# EAGLE design 3y-ym-2xxxy-psu-breakout (EAGLE 9.6.2)
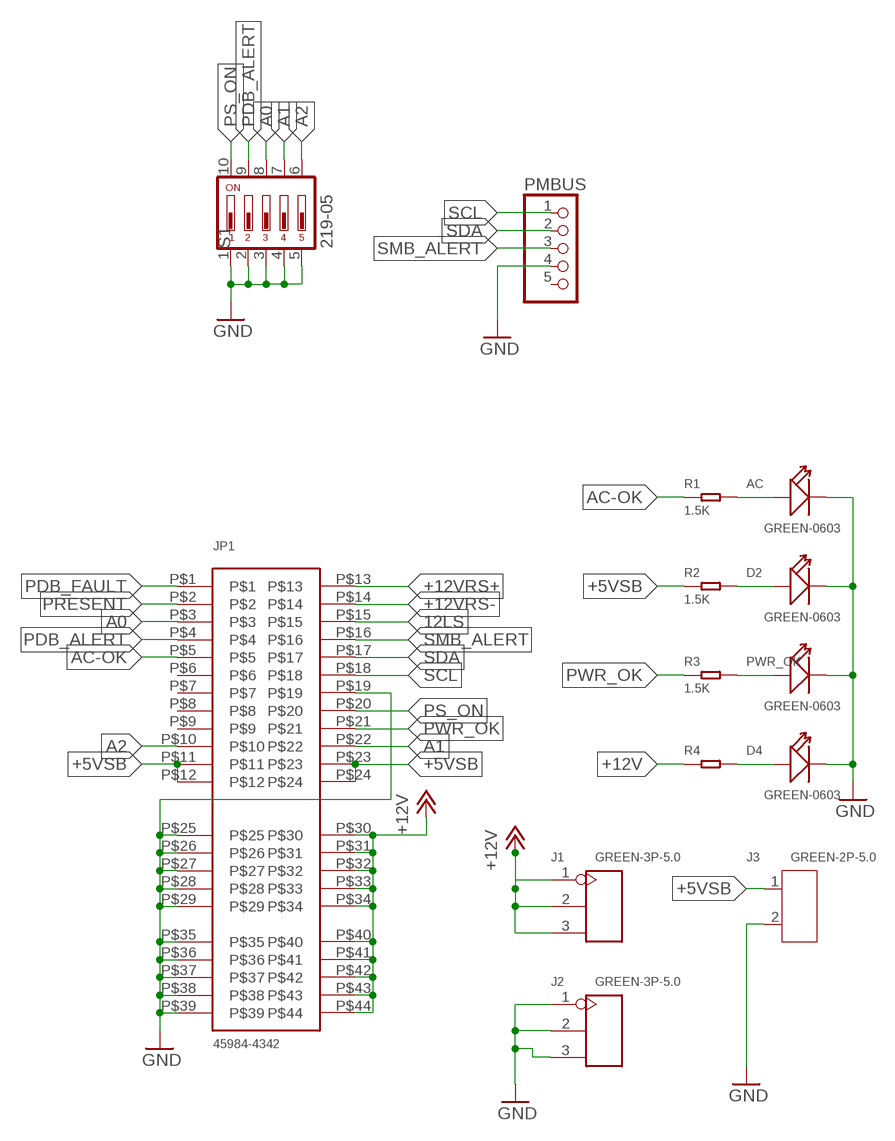
[diagram p0: schematic, sheet 1]

## Parts
AC  GREEN-0603  SMD-LED-CLEAR-GREEN(0603)  [LED-0603]
D2  GREEN-0603  SMD-LED-CLEAR-GREEN(0603)  [LED-0603]
D4  GREEN-0603  SMD-LED-CLEAR-GREEN(0603)  [LED-0603]
J1  GREEN-3P-5.0  SCREW-TERMINAL-GREEN(3P-5.0)  [H3-5.0-15.5X8.0MM]
J2  GREEN-3P-5.0  SCREW-TERMINAL-GREEN(3P-5.0)  [H3-5.0-15.5X8.0MM]
J3  GREEN-2P-5.0  SCREW-TERMINAL-GREEN(2P-5.0)  [H2-5.0-10.5X8.0MM]
JP1  45984-4342  [45984-4342]
PMBUS  PINHD-1X5  [1X05]
PWR_OK  GREEN-0603  SMD-LED-CLEAR-GREEN(0603)  [LED-0603]
R1  1.5K  SMD-RES-150R-1%-1/10W(0603)  [R0603]
R2  1.5K  SMD-RES-150R-1%-1/10W(0603)  [R0603]
R3  1.5K  SMD-RES-150R-1%-1/10W(0603)  [R0603]
R4  1.5K  SMD-RES-510R-1%-1/10W(0603)  [R0603]
S1  219-05  [CTS-219-05]

## Nets
12LS: JP1.P$15
+5VSB: J3.1 JP1.P$11 JP1.P$12 JP1.P$23 JP1.P$24 R2.1
+12V: J1.1 J1.2 J1.3 JP1.P$30 JP1.P$31 JP1.P$32 JP1.P$33 JP1.P$34 JP1.P$40 JP1.P$41 JP1.P$42 JP1.P$43 JP1.P$44 R4.1
+12VRS+: JP1.P$13
+12VRS-: JP1.P$14
A0: JP1.P$3 S1.8
A1: JP1.P$22 S1.7
A2: JP1.P$10 S1.6
AC-OK: JP1.P$5 R1.1
GND: AC.- D2.- D4.- J2.1 J2.2 J2.3 J3.2 JP1.P$19 JP1.P$25 JP1.P$26 JP1.P$27 JP1.P$28 JP1.P$29 JP1.P$35 JP1.P$36 JP1.P$37 JP1.P$38 JP1.P$39 PMBUS.4 PWR_OK.- S1.1 S1.2 S1.3 S1.4 S1.5
N$2: AC.+ R1.2
N$3: D2.+ R2.2
N$4: PWR_OK.+ R3.2
N$5: D4.+ R4.2
PDB_ALERT: JP1.P$4 S1.9
PDB_FAULT: JP1.P$1
PRESENT: JP1.P$2
PS_ON: JP1.P$20 S1.10
PWR_OK: JP1.P$21 R3.1
SCL: JP1.P$18 PMBUS.1
SDA: JP1.P$17 PMBUS.2
SMB_ALERT: JP1.P$16 PMBUS.3
Unconnected: JP1.P$6 JP1.P$7 JP1.P$8 JP1.P$9 PMBUS.5

## Library data of the parts
AC D2 D4 PWR_OK = OPL_Optoelectronics:SMD-LED-CLEAR-GREEN(0603): 304090043; MPN: 19-217-G7C-AN1P2-3T
J1 J2 = OPL_Connector:SCREW-TERMINAL-GREEN(3P-5.0): 320110029
J3 = OPL_Connector:SCREW-TERMINAL-GREEN(2P-5.0): 320110031
JP1 = Molex EXTreme LPHPower:45984-4342: 459844342 1.27mm, 12.00mm Pitch, EXTreme LPHPower Receptacle Header, Right-Angle, 4 Power Contacts, 24 Signal Contacts, Select Gold (Au) Plating, for 2.36mm Thick PC Board, with Press-fit Plastic Pegs Series: 45984 <https://www.molex.com/molex/search/partSearch?query=45984&pQuery=> Category: PCB Receptacles Overview: EXTreme LPHPower Connectors <https://www.molex.com/molex/products/family/extreme_lphpower>
PMBUS = pinhead:PINHD-1X5: PIN HEADER
R1-R3 = OPL_Resistor:SMD-RES-150R-1%-1/10W(0603): 301012037; MPN: RC0603FR-071K5L
R4 = OPL_Resistor:SMD-RES-510R-1%-1/10W(0603): 301012082
S1 = switch-dil:219-05*: Surface Mount DIP Switch Series 219 SMT CTS Electronic Components Sourc: www.ctscorp.com; OC_FARNELL: unknown; OC_NEWARK: unknown

## Board
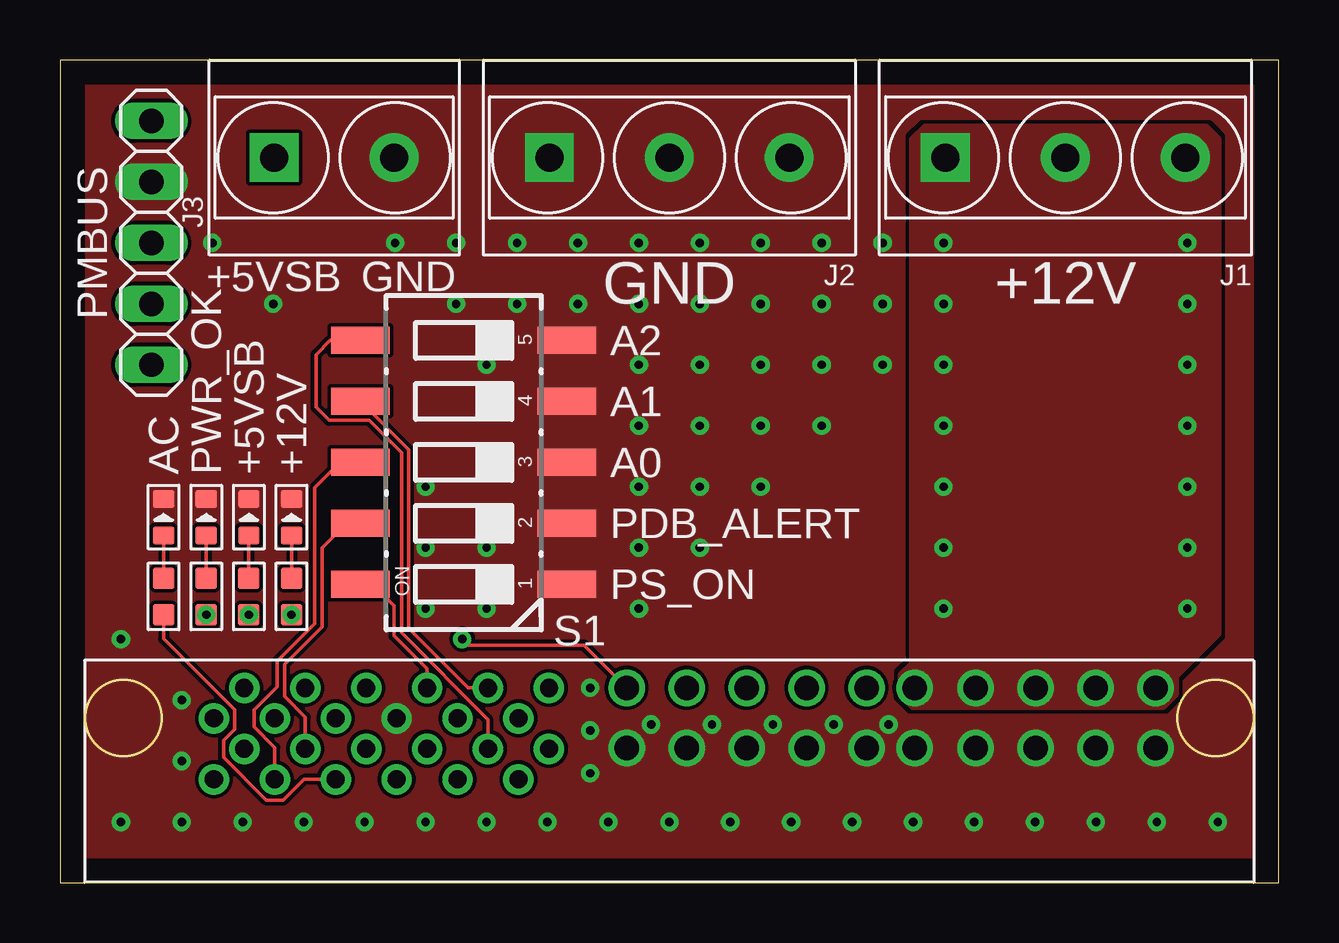
[diagram p1: board, top side]
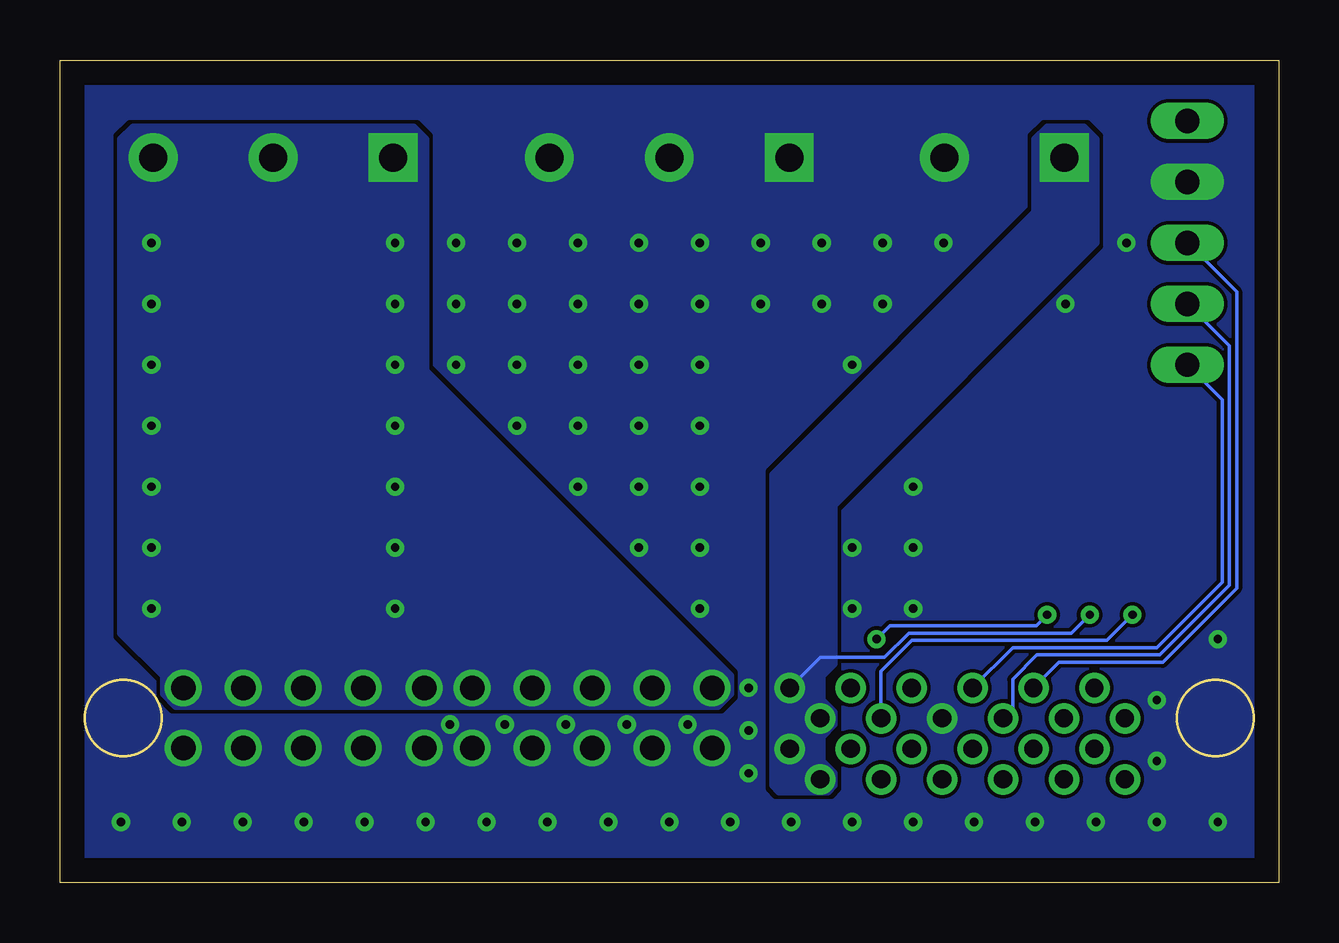
[diagram p2: board, bottom side, seen from below]

Size 50.8 x 34.29 mm. Coordinates in mm from the lower left corner, seen from the top.
Outline: 0,0 50.8,0 50.8,34.29 0,34.29 0,0
Copper layers (1*16): Top 0.035mm / dielectric 1.5mm / Bottom 0.035mm
Design rules "default": minimum track width 6mil, minimum drill 0.35mm, track to track 6mil, track to pad 6mil, pad to pad 6mil, via to via 6mil, smd to smd 6mil, copper to edge 40mil, drill to drill 6mil, minimum pad ring 10mil, minimum via ring 8mil, stop-mask expansion 4mil, vias tented up to drill 0mil, thermal gap 10mil

### Footprints (pad centres in the part's own frame; a part is rotated, then mirrored left to right if it is on the bottom)
LED-0603 = smd 0.762 x 0.889: + -0.762,0; - 0.762,0
H3-5.0-15.5X8.0MM = drill 1.168 pad 2.032 square: 1 0,5 | drill 1.168 pad 2.032: 2 0,0; 3 0,-5
H2-5.0-10.5X8.0MM = drill 1.168 pad 2.032 square: 1 0,2.5 | drill 1.168 pad 2.032: 2 0,-2.5
45984-4342 = drill 0.76: P$1 -17.21,-3.81; P$2 -15.94,-2.54; P$3 -14.67,-3.81; P$4 -13.4,-2.54; P$5 -12.13,-3.81; P$6 -10.86,-2.54; P$7 -9.59,-3.81; P$8 -8.32,-2.54; P$9 -7.05,-3.81; P$10 -5.78,-2.54; P$11 -4.51,-3.81; P$12 -3.24,-2.54; P$13 -17.21,-1.27; P$14 -15.94,0; P$15 -14.67,-1.27; P$16 -13.4,0; P$17 -12.13,-1.27; P$18 -10.86,0; P$19 -9.59,-1.27; P$20 -8.32,0; P$21 -7.05,-1.27; P$22 -5.78,0; P$23 -4.51,-1.27; P$24 -3.24,0 | drill 1.02: P$25 0,-2.5; P$26 2.5,-2.5; P$27 5,-2.5; P$28 7.5,-2.5; P$29 10,-2.5; P$30 0,0; P$31 2.5,0; P$32 5,0; P$33 7.5,0; P$34 10,0; P$35 12,-2.5; P$36 14.54,-2.5; P$37 17.04,-2.5; P$38 19.54,-2.5; P$39 22.04,-2.5; P$40 12,0; P$41 14.54,0; P$42 17.04,0; P$43 19.54,0; P$44 22.04,0
1X05 = drill 1.016 long: 1 -5.08,0; 2 -2.54,0; 3 0,0; 4 2.54,0; 5 5.08,0
R0603 = smd 0.889 x 0.889: 1 0,0.762; 2 0,-0.762
CTS-219-05 = smd 1.13 x 2.44: 1 -5.08,-4.3; 2 -2.54,-4.3; 3 0,-4.3; 4 2.54,-4.3; 5 5.08,-4.3; 6 5.08,4.3; 7 2.54,4.3; 8 0,4.3; 9 -2.54,4.3; 10 -5.08,4.3

### Placement (x,y rotation side)
AC  4.32,15.24 90 top
D2  7.87,15.24 90 top
D4  9.65,15.24 90 top
J1  41.91,30.23 90 top
J2  25.4,30.23 90 top
J3  11.43,30.23 90 top
JP1  23.62,8.13 0 top
PMBUS  3.81,26.67 90 top
PWR_OK  6.1,15.24 90 top
R1  4.32,11.94 180 top
R2  7.87,11.94 180 top
R3  6.1,11.94 180 top
R4  9.65,11.94 180 top
S1  16.83,17.53 90 top

### Tracks (layer width: path | path; a pad name or v marks a point on that pad's centre or on a via)
+5VSB  (via drill 0.35)
  Bottom 0.152: JP1.P$24 19.11,9.4 16.43,9.4 15.42,10.41 8.64,10.41 R2.1
  other vias: 7.87,11.18
  pour Bottom (no thermals): 18.54,4.06 18.8,3.81 20.83,3.81 21.08,4.06 21.08,17.02 10.16,27.94 10.16,30.99 9.65,31.5 8.13,31.5 7.62,30.99 7.62,26.67 18.54,15.75 18.54,9.14 19.05,8.64 19.05,7.62 18.54,7.11 18.54,6.6 19.05,6.1 19.05,5.08 18.54,4.57
+12V  (via drill 0.35)
  Top 0.152: JP1.P$30 21.84,9.91 17.02,9.91 v16.76,10.16
  Bottom 0.152: R4.1 10.11,10.72 16.2,10.72 v16.76,10.16
  other vias: 9.65,11.18 36.83,26.67 46.99,26.67 36.83,24.13 36.83,21.59 36.83,19.05 36.83,16.51 36.83,13.97 36.83,11.43 46.99,24.13 46.99,21.59 46.99,19.05 46.99,16.51 46.99,13.97 46.99,11.43
  pour Top (no thermals): 35.08,8.67 35.06,7.87 35.56,7.37 45.97,7.37 46.48,7.87 46.48,8.64 48.26,10.41 48.26,30.99 47.75,31.5 36.07,31.5 35.56,30.99 35.56,9.14
  pour Bottom (no thermals): 22.86,8.64 22.86,7.87 23.37,7.37 45.97,7.37 46.48,7.87 46.48,8.64 48.26,10.41 48.26,30.99 47.75,31.5 36.07,31.5 35.56,30.99 35.56,21.34
A0
  Top 0.152: JP1.P$3 8.95,5.64 8.09,6.5 8.09,7.21 9.05,8.18 9.05,9.23 10.62,10.79 10.62,16.46 11.68,17.53 S1.8
A1
  Top 0.152: JP1.P$22 17.02,8.13 14.54,10.61 14.54,18.06 S1.7
A2
  Top 0.152: S1.6 11.26,22.61 10.67,22.02 10.67,19.82 11.21,19.27 12.89,19.27 14.23,17.93 14.23,10.42 17.84,6.81 JP1.P$10
AC-OK
  Top 0.152: R1.1 4.32,10.17 7.28,7.21 7.28,6.4 6.82,5.95 6.82,5.23 8.6,3.46 9.31,3.46 10.17,4.32 JP1.P$5
GND  (via drill 0.35)
  other vias: 24.13,11.43 24.13,13.97 26.67,13.97 26.67,16.51 24.13,16.51 29.21,16.51 29.21,19.05 26.67,19.05 24.13,19.05 26.67,21.59 24.13,21.59 29.21,21.59 31.75,21.59 31.75,24.13 29.21,24.13 26.67,24.13 24.13,24.13 34.29,24.13 34.29,21.59 31.75,19.05 25.4,2.54 27.94,2.54 30.48,2.54 33.02,2.54 35.56,2.54 38.1,2.54 40.64,2.54 43.18,2.54 45.72,2.54 48.26,2.54 22.86,2.54 20.32,2.54 17.78,2.54 15.24,2.54 12.7,2.54 10.16,2.54 7.62,2.54 5.08,2.54 2.54,2.54 21.59,24.13 34.29,26.67 31.75,26.67 29.21,26.67 26.67,26.67 24.13,26.67 21.59,26.67 19.05,26.67 19.05,24.13 16.51,24.13 16.51,26.67 13.97,26.67 6.35,26.67 8.89,24.13 17.78,21.59 15.24,16.51 15.24,13.97 17.78,13.97 15.24,11.43 17.78,11.43 2.54,10.16 5.08,7.62 5.08,5.08 22.1,6.35 22.1,8.13 22.1,4.57 24.64,6.6 27.18,6.6 29.72,6.6 32.26,6.6 34.54,6.6
  pour Bottom (rank 6, no thermals): 0,34.29 0,0 50.8,0 50.8,34.29
  pour Top (rank 6, no thermals): 0,34.29 0,0 50.8,0 50.8,34.29
N$2
  Top 0.152: AC.+ R1.2
N$3
  Top 0.152: D2.+ R2.2
N$4
  Top 0.152: PWR_OK.+ R3.2
N$5
  Top 0.152: D4.+ R4.2
PDB_ALERT
  Top 0.152: JP1.P$4 10.22,6.91 9.36,7.77 9.36,9.11 10.92,10.67 10.92,13.97 11.94,14.99 S1.9
PS_ON
  Top 0.152: JP1.P$20 15.3,8.92 13.93,10.29 13.93,11.56 13.04,12.45 S1.10
PWR_OK  (via drill 0.35)
  Bottom 0.152: JP1.P$21 16.57,8.83 15.29,10.11 7.16,10.11 R3.1
  other vias: 6.1,11.18
SCL
  Bottom 0.152: JP1.P$18 11.09,9.8 5.08,9.8 2.36,12.53 2.36,20.14 PMBUS.1
SDA
  Bottom 0.152: PMBUS.2 2.06,22.38 2.06,12.4 4.96,9.5 10.07,9.5 11.09,8.48 11.09,7.26 JP1.P$17
SMB_ALERT
  Bottom 0.152: PMBUS.3 3.79,26.67 1.75,24.64 1.75,12.28 4.83,9.19 9.16,9.19 JP1.P$16

### Text on the board
tNames: +5VSB | GND | GND | +12V | A2 | A1 | A0 | +5VSB | +12V | PDB_ALERT | PS_ON